# Altium schematic sheet Esquematico.SchDoc
size A4; PageSetup: Record=PageOptions|CenterHorizontal=True|CenterVertical=True|PrintScale=1.00|XCorrection=1.00|YCorrection=1.00|PrintKind=0|BorderSize=5000000|LeftOffset=0|BottomOffset=0|Orientation=2|PaperLength=1000|PaperWidth=1000|Scale=100|PaperSource=7|PrintQuality=-3|MediaType=1|DitherType=10|PrintScaleMode=0|PaperKind=A4|PaperIndex=9
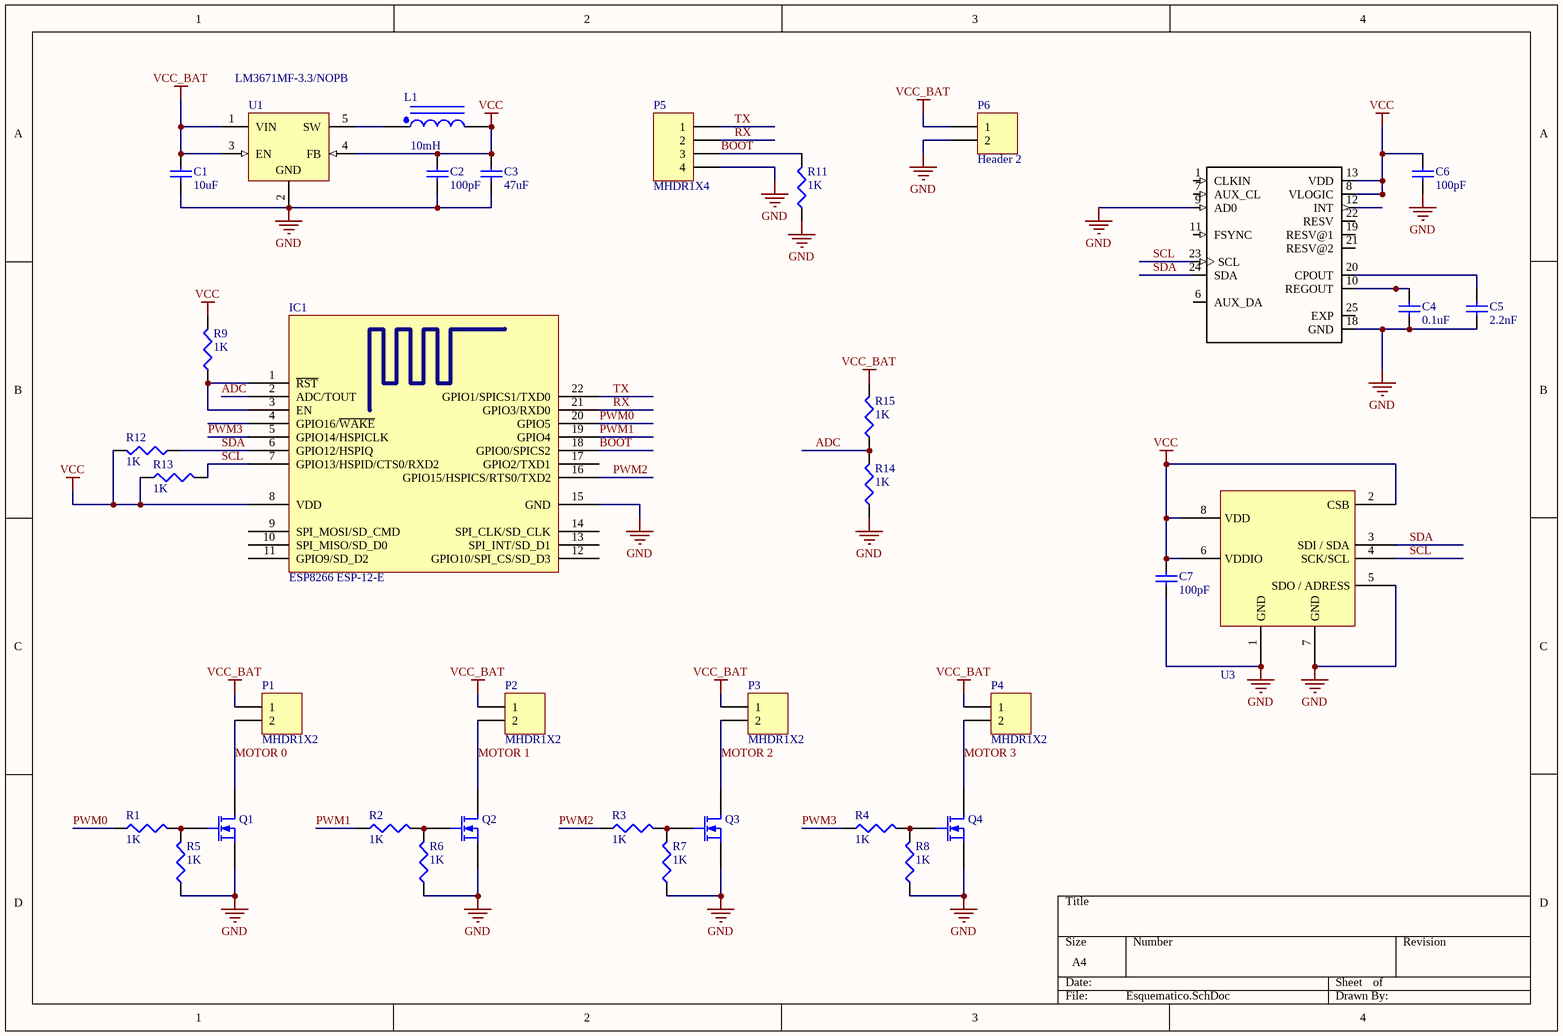
[diagram p0: Esquematico.SchDoc]

## Parts
C1  value 10uF  [6-0805_L]  (hidden comment: Cap)
C2  value 100pF  [6-0805_L]  (hidden comment: Cap)
C3  value 47uF  [6-0805_L]  (hidden comment: Cap)
C4  value 0.1uF  [6-0805_L]  (hidden comment: Cap)
C5  value 2.2nF  [6-0805_L]  (hidden comment: Cap)
C6  value 100pF  [6-0805_L]  (hidden comment: Cap)
C7  value 100pF  [6-0805_L]  (hidden comment: Cap)
IC1  ESP8266 ESP-12-E  [ESP8266 ESP-12-E B]
L1  value 10mH  [Inductor CD43]  (hidden comment: Inductor Iron Dot)
P1  MHDR1X2  [MHDR1X2]
P2  MHDR1X2  [MHDR1X2]
P3  MHDR1X2  [MHDR1X2]
P4  MHDR1X2  [MHDR1X2]
P5  MHDR1X4  [MHDR1X4]
P6  Header 2  [HDR1X2]
Q1  MOSFET-N  [SOT23-3]  (value not drawn)
Q2  MOSFET-N  [SOT23-3]  (value not drawn)
Q3  MOSFET-N  [SOT23-3]  (value not drawn)
Q4  MOSFET-N  [SOT23-3]  (value not drawn)
R1  value 1K  [6-0805_N]  (hidden comment: Res3)
R2  value 1K  [6-0805_N]  (hidden comment: Res3)
R3  value 1K  [6-0805_N]  (hidden comment: Res3)
R4  value 1K  [6-0805_N]  (hidden comment: Res3)
R5  value 1K  [6-0805_N]  (hidden comment: Res3)
R6  value 1K  [6-0805_N]  (hidden comment: Res3)
R7  value 1K  [6-0805_N]  (hidden comment: Res3)
R8  value 1K  [6-0805_N]  (hidden comment: Res3)
R9  value 1K  [6-0805_L]  (hidden comment: Res3)
R11  value 1K  [6-0805_L]  (hidden comment: Res3)
R12  value 1K  [6-0805_L]  (hidden comment: Res3)
R13  value 1K  [6-0805_L]  (hidden comment: Res3)
R14  value 1K  [6-0805_L]  (hidden comment: Res3)
R15  value 1K  [6-0805_L]  (hidden comment: Res3)
U1  LM3671MF-3.3/NOPB  [MF05A_N]
U2  MPU-6050  [QFN50P400X400X95-25N]  (value not drawn)
U3  BMP280  [LGA-8_BMP280(Primary)]  (value not drawn)

## Nets
GND: C1.1 C2.1 C3.1 C4.1 C5.1 C6.1 C7.1 IC1.15(GND) P5.4 P6.2 Q1.3(S) Q2.3(S) Q3.3(S) Q4.3(S) R5.1 R6.1 R7.1 R8.1 R11.1 R14.1 U1.2(GND) U2.9(AD0) U2.18(GND) U3.1(GND) U3.5(SDO_/_ADRESS) U3.7(GND)
VCC: C2.2 C3.2 C6.2 C7.2 IC1.8(VDD) L1.2 R9.2 R12.2 R13.1 U1.4(FB) U2.8(VLOGIC) U2.13(VDD) U3.2(CSB) U3.6(VDDIO) U3.8(VDD)
VCC_BAT: C1.2 P1.1 P2.1 P3.1 P4.1 P6.1 R15.2 U1.1(VIN) U1.3(EN)
ADC: IC1.2(ADC/TOUT) R14.2 R15.1
BOOT: IC1.18(GPIO0/SPICS2) P5.3 R11.2
MOTOR 0: P1.2 Q1.1(D)
MOTOR 1: P2.2 Q2.1(D)
MOTOR 2: P3.2 Q3.1(D)
MOTOR 3: P4.2 Q4.1(D)
PWM0: IC1.20(GPIO5) R1.1
PWM1: IC1.19(GPIO4) R2.1
PWM2: IC1.16(GPIO15/HSPICS/RTS0/TXD2) R3.1
PWM3: IC1.5(GPIO14/HSPICLK) R4.1
RX: IC1.21(GPIO3/RXD0) P5.2
SCL: IC1.7(GPIO13/HSPID/CTS0/RXD2) R13.2 U2.23(SCL) U3.4(SCK/SCL)
SDA: IC1.6(GPIO12/HSPIQ) R12.1 U2.24(SDA) U3.3(SDI_/_SDA)
TX: IC1.22(GPIO1/SPICS1/TXD0) P5.1
NetC4_2: C4.2 U2.10(REGOUT)
NetC5_2: C5.2 U2.20(CPOUT)
NetIC1_1: IC1.1(~{RST}) IC1.3(EN) R9.1
NetL1_1: L1.1 U1.5(SW)
NetQ1_2: Q1.2(G) R1.2 R5.2
NetQ2_2: Q2.2(G) R2.2 R6.2
NetQ3_2: Q3.2(G) R3.2 R7.2
NetQ4_2: Q4.2(G) R4.2 R8.2

Not connected (* = marked no-connect by the designer): IC1 4(GPIO16/~{WAKE}) 9(SPI_MOSI/SD_CMD) 10(SPI_MISO/SD_D0) 11(GPIO9/SD_D2) 12(GPIO10/SPI_CS/SD_D3) 13(SPI_INT/SD_D1) 14(SPI_CLK/SD_CLK) 17(GPIO2/TXD1); U2 1(CLKIN) 6(AUX_DA) 7(AUX_CL) 11(FSYNC) 12(INT) 19(RESV@1) 21(RESV@2) 22(RESV) 25(EXP)

## Library data of the parts
C1-C7 = Cap: Capacitor; Published: 8-Jun-2000; LatestRevisionDate: 17-Jul-2002; LatestRevisionNote: Re-released for DXP Platform.; PackageReference: RAD-0.3; Publisher: Altium Limited; PackageDescription: Radial Cap, Thru-Hole; 2 Leads; 0.3 in Pin Spacing
L1 = Inductor Iron Dot: Magnetic-Core Inductor with Winding Polarity Marking; Published: 24-Mar-1999; LatestRevisionDate: 17-Jul-2002; LatestRevisionNote: Re-released for DXP Platform.; PackageReference: DIODE_SMC; Publisher: Altium Limited; PackageDescription: Diode; 2 Leads
P1-P4 = MHDR1X2: Header, 2-Pin; LatestRevisionDate: 17-Jul-2002; LatestRevisionNote: Re-released for DXP Platform.; Publisher: Altium Limited
P5 = MHDR1X4: Header, 4-Pin; LatestRevisionDate: 17-Jul-2002; LatestRevisionNote: Re-released for DXP Platform.; Publisher: Altium Limited
P6 = Header 2: Header, 2-Pin; LatestRevisionDate: 17-Jul-2002; LatestRevisionNote: Re-released for DXP Platform.; Publisher: Altium Limited
Q1-Q4 = MOSFET-N: N-Channel MOSFET; pin to pad: 1>3 2>1 3>2; Published: 8-Jun-2000; LatestRevisionDate: 17-Jul-2002; LatestRevisionNote: Re-released for DXP Platform.; PackageVersion: 1995/1996; PackageReference: E3; Publisher: Altium Limited; PackageDescription: TO, Flat Index; 3 In-Line, Axial Leads; Body Dia. 4.6mm; Lead Dia. 0.5 mm (max)
R1-R9 R11-R15 = Res3: Resistor; Published: 8-Jun-2000; LatestRevisionDate: 29-May-2009; LatestRevisionNote: IPC-7351 Footprint Added.; PackageReference: J1-0603; Publisher: Altium Limited; PackageDescription: Chip Resistor
U1 = LM3671MF-3.3/NOPB: 2MHz, 600mA Step-Down DC-DC Converter, 5-pin SOT-23, Pb-Free; Manufacturer: National Semiconductor; PackageTopMarking: SJEB*XTT; PowerWise: Y; CompType: MiscPower; Published: 1-Mar-2010; DatasheetVersion: Oct-2008; PackageVersion: revD, Aug-2008; PackageReference: MF05A; Publisher: Altium Limited; PackageDescription: Molded SOT-23, .115 x .063 x .040 in Body, 5 Lead, .0375 in Pitch; Supplier 1: Digi-Key; Supplier Part Number 1: LM3671MF-3.3TR-ND; Supplier 2: Digi-Key; Supplier Part Number 2: LM3671MF-3.3CT-ND; Supplier 3: Digi-Key; Supplier Part Number 3: LM3671MF-3.3DKR-ND; Supplier 4: Farnell; Supplier Part Number 4: 1685767; PartNumber: LM3671MF-3.3/NOPB; RoHS: Y; PinCount: 5; ComponentLink1Description: LM3671 Datasheet; ComponentLink1URL: http://www.national.com/ds/LM/LM3671.pdf; ComponentLink2Description: LM3671 Web Page; ComponentLink2URL: http://www.national.com/pf/LM/LM3671.html; ComponentLink3Description: MF05A Package Page; ComponentLink3URL: http://www.national.com/packaging/folders/mf05a.html
U3 = BMP280: Barometro; Value: *
U2 = MPU-6050: Value: *